# Altium schematic sheet Connector.SchDoc
size 420 x 297 mm; SheetNumber: 5; SheetTotal: 5
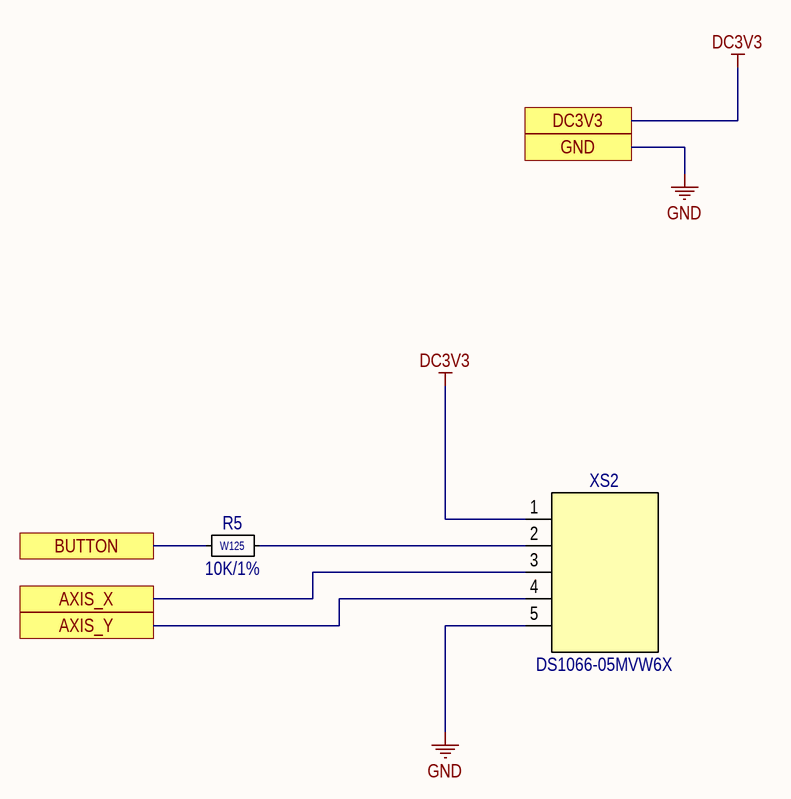
[diagram p0: Connector.SchDoc]

## Parts
R5  value 10K/1%  [SMD_RES_0805-L2000-W1250-H500-M1002]  (hidden comment: CR0805-10K-1%)
XS2  DS1066-05MVW6X  [DS1066-05MVWXX]

## Ports
AXIS_X, AXIS_Y, BUTTON, DC3V3, GND

## Nets
DC3V3: XS2.1 ; port DC3V3
GND: XS2.5 ; port GND
AXIS_X: XS2.3 ; port AXIS_X
AXIS_Y: XS2.4 ; port AXIS_Y
BUTTON: R5.1 ; port BUTTON
NetR5_2: R5.2 XS2.2

## Notes on the sheet
- Ревизия
- Дата
- Проект
- Изм.
- Лист
- № докум.
- Стр.
- Подп.
- (in symbol CR0805-10K-1%) W125

## Library data of the parts
R5 = CR0805-10K-1%: Film resistor SMD 0805